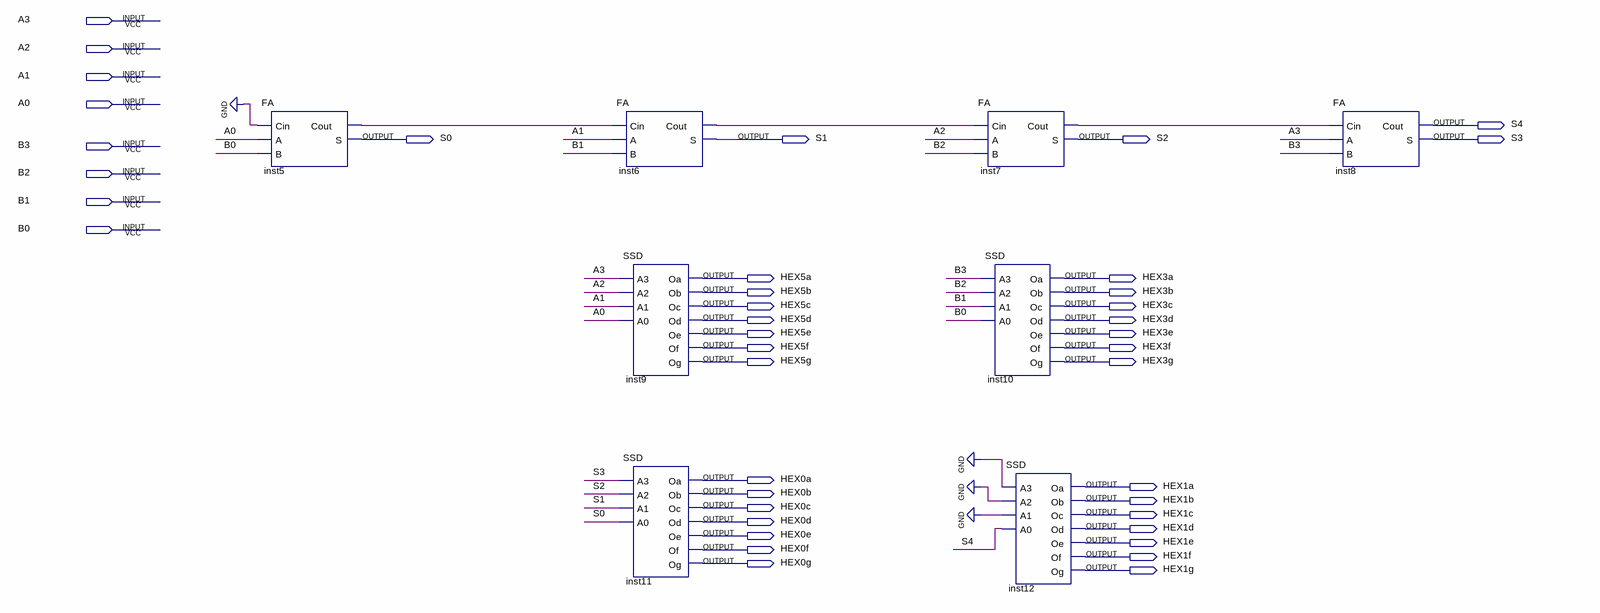
[diagram p0: schematic sheet]
// Quartus schematic homework03.bdf as structural Verilog: 8 symbols, 41 pins
module homework03 (
  input  A3,
  input  A2,
  input  A1,
  input  A0,
  input  B3,
  input  B2,
  input  B1,
  input  B0,
  output S4,
  output S0,
  output S1,
  output S2,
  output S3,
  output HEX5a,
  output HEX3a,
  output HEX5b,
  output HEX3b,
  output HEX5c,
  output HEX3c,
  output HEX5d,
  output HEX3d,
  output HEX5e,
  output HEX3e,
  output HEX5f,
  output HEX3f,
  output HEX5g,
  output HEX3g,
  output HEX0a,
  output HEX1a,
  output HEX0b,
  output HEX1b,
  output HEX0c,
  output HEX1c,
  output HEX0d,
  output HEX1d,
  output HEX0e,
  output HEX1e,
  output HEX0f,
  output HEX1f,
  output HEX0g,
  output HEX1g
);

  wire inst5_cout, inst6_cout, inst7_cout;

  FA inst5 (.Cin(1'b0), .A(A0), .B(B0), .Cout(inst5_cout), .S(S0));
  FA inst6 (.Cin(inst5_cout), .A(A1), .B(B1), .Cout(inst6_cout), .S(S1));
  SSD inst9 (
    .A3(A3), .A2(A2), .A1(A1), .A0(A0), .Oa(HEX5a), .Ob(HEX5b), .Oc(HEX5c), .Od(HEX5d), .Oe(HEX5e),
    .Of(HEX5f), .Og(HEX5g));
  SSD inst11 (
    .A3(S3), .A2(S2), .A1(S1), .A0(S0), .Oa(HEX0a), .Ob(HEX0b), .Oc(HEX0c), .Od(HEX0d), .Oe(HEX0e),
    .Of(HEX0f), .Og(HEX0g));
  FA inst7 (.Cin(inst6_cout), .A(A2), .B(B2), .Cout(inst7_cout), .S(S2));
  SSD inst10 (
    .A3(B3), .A2(B2), .A1(B1), .A0(B0), .Oa(HEX3a), .Ob(HEX3b), .Oc(HEX3c), .Od(HEX3d), .Oe(HEX3e),
    .Of(HEX3f), .Og(HEX3g));
  SSD inst12 (
    .A3(1'b0), .A2(1'b0), .A1(1'b0), .A0(S4), .Oa(HEX1a), .Ob(HEX1b), .Oc(HEX1c), .Od(HEX1d), .Oe(HEX1e),
    .Of(HEX1f), .Og(HEX1g));
  FA inst8 (.Cin(inst7_cout), .A(A3), .B(B3), .Cout(S4), .S(S3));
endmodule
